# EAGLE design rev1 (EAGLE 7.7.0)
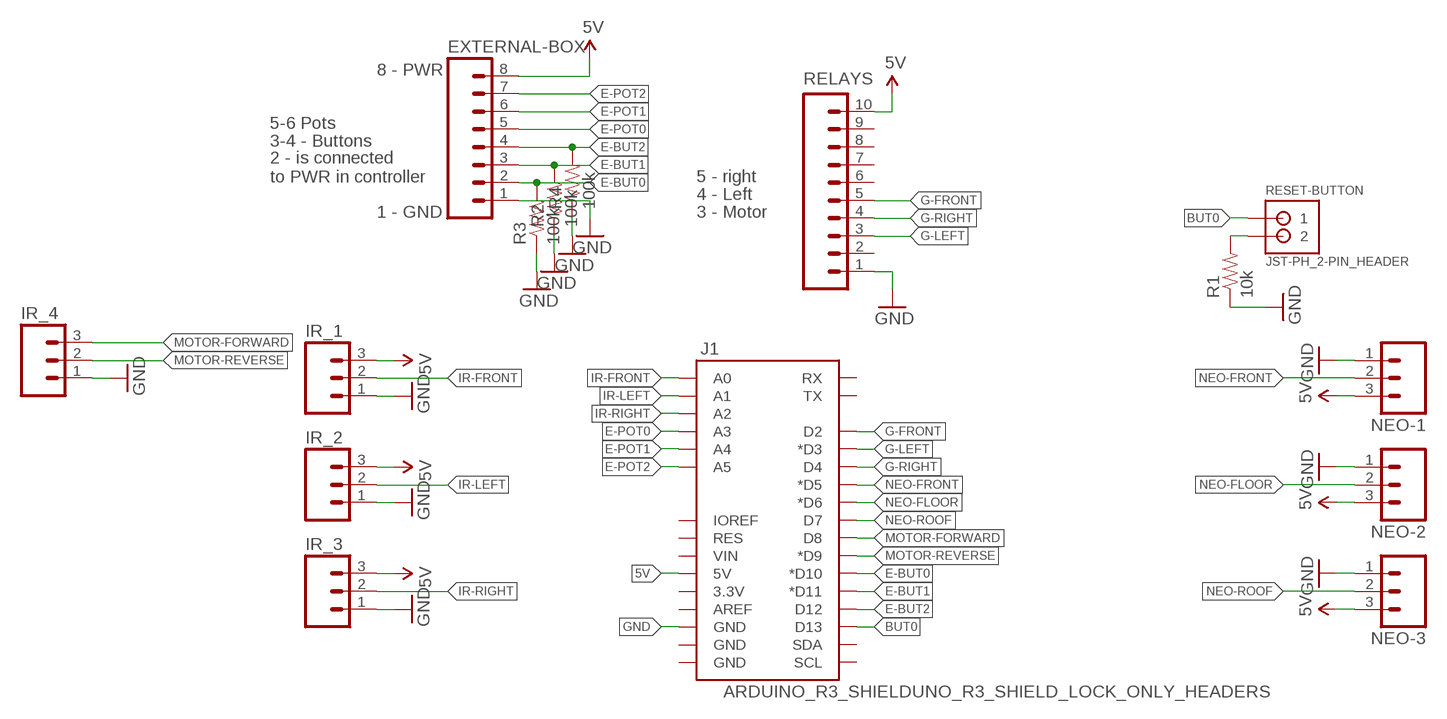
[diagram p0: schematic, sheet 1]

## Parts
EXTERNAL-BOX  M08NO_SILK  [1X08_PIN1_NO_SILK]
IR_1  M03POLAR  [MOLEX-1X3]
IR_2  M03POLAR  [MOLEX-1X3]
IR_3  M03POLAR  [MOLEX-1X3]
IR_4  M03POLAR  [MOLEX-1X3]
J1  ARDUINO_R3_SHIELDUNO_R3_SHIELD_LOCK_ONLY_HEADERS  [UNO_R3_SHIELD_ONLY_HEADERS]
NEO-1  M03POLAR  [MOLEX-1X3]
NEO-2  M03POLAR  [MOLEX-1X3]
NEO-3  M03POLAR  [MOLEX-1X3]
R1  10k  RESISTORAXIAL-0.3  [AXIAL-0.3]
R2  100k  RESISTORAXIAL-0.3  [AXIAL-0.3]
R3  100k  RESISTORAXIAL-0.3  [AXIAL-0.3]
R4  100k  RESISTORAXIAL-0.3  [AXIAL-0.3]
RELAYS  M10NO_SILK_PTH_FEMALE  [1X10_NO_SILK]
RESET-BUTTON  JST-PH_2-PIN_HEADER  [JST_B2B-PH_HEADER]

## Nets
5V: EXTERNAL-BOX.8 IR_1.3 IR_2.3 IR_3.3 J1.5V NEO-1.3 NEO-2.3 NEO-3.3 RELAYS.10
BUT0: J1.D13 RESET-BUTTON.P1
E-BUT0: EXTERNAL-BOX.2 J1.D10(*D10) R3.P$2
E-BUT1: EXTERNAL-BOX.3 J1.D11(*D11) R2.P$2
E-BUT2: EXTERNAL-BOX.4 J1.D12 R4.P$2
E-POT0: EXTERNAL-BOX.5 J1.A3
E-POT1: EXTERNAL-BOX.6 J1.A4
E-POT2: EXTERNAL-BOX.7 J1.A5
G-FRONT: J1.D2 RELAYS.5
G-LEFT: J1.D3(*D3) RELAYS.3
G-RIGHT: J1.D4 RELAYS.4
GND: EXTERNAL-BOX.1 IR_1.1 IR_2.1 IR_3.1 IR_4.1 J1.GND@2(GND) NEO-1.1 NEO-2.1 NEO-3.1 R1.P$1 R2.P$1 R3.P$1 R4.P$1 RELAYS.1
IR-FRONT: IR_1.2 J1.A0
IR-LEFT: IR_2.2 J1.A1
IR-RIGHT: IR_3.2 J1.A2
MOTOR-FORWARD: IR_4.3 J1.D8
MOTOR-REVERSE: IR_4.2 J1.D9(*D9)
N$2: R1.P$2 RESET-BUTTON.P2
NEO-FLOOR: J1.D6(*D6) NEO-2.2
NEO-FRONT: J1.D5(*D5) NEO-1.2
NEO-ROOF: J1.D7 NEO-3.2
Unconnected: J1.3.3V J1.AREF J1.GND@0(GND) J1.GND@1(GND) J1.IOREF J1.RES J1.RX J1.SCL J1.SDA J1.TX J1.VIN RELAYS.2 RELAYS.6 RELAYS.7 RELAYS.8 RELAYS.9

## Notes on the sheet
- 8 - PWR
- 5-6 Pots
- 3-4 - Buttons
- 2 - is connected
  to PWR in controller
- 5 - right
- 4 - Left
- 1 - GND | 3 - Motor

## Library data of the parts
EXTERNAL-BOX = SparkFun-Connectors:M08: Header 8 Standard 8-pin 0.1" header. Use with straight break away headers (SKU : PRT-00116), right angle break away headers (PRT-00553), swiss pins (PRT-00743), machine pins (PRT-00117), and female headers (PRT-00115).
IR_1-IR_4 NEO-1-NEO-3 = SparkFun-Connectors:M03: Header 3 Standard 3-pin 0.1" header. Use with straight break away headers (SKU : PRT-00116), right angle break away headers (PRT-00553), swiss pins (PRT-00743), machine pins (PRT-00117), and female headers (PRT-00115). Molex polarized connector foot print use with SKU : PRT-08232 with associated crimp pins and housings.
J1 = Arduino-Uno-Mega:ARDUINO_R3_SHIELD: Shield form compatible with the Arduino Uno R3.
R1-R4 = SparkFun-Passives:RESISTOR: Resistor Basic schematic elements and footprints for 0603, 1206, and PTH resistors.
RELAYS = SparkFun-Connectors:M10: Header 10 Standard 10-pin 0.1" header. Use with straight break away headers (SKU : PRT-00116), right angle break away headers (PRT-00553), swiss pins (PRT-00743), machine pins (PRT-00117), and female headers (PRT-00115).; PROD_ID: CONN-11563
RESET-BUTTON = JST_connectors:JST-PH_2-PIN_HEADER: 2-pin JST PH Shrouded Header, top entry P/N B2B-PH-K-S Mating connector PHR-2 Mating cable assembly: Sparkfun PRT-09914 <http://www.sparkfun.com/products/9914>

## Board
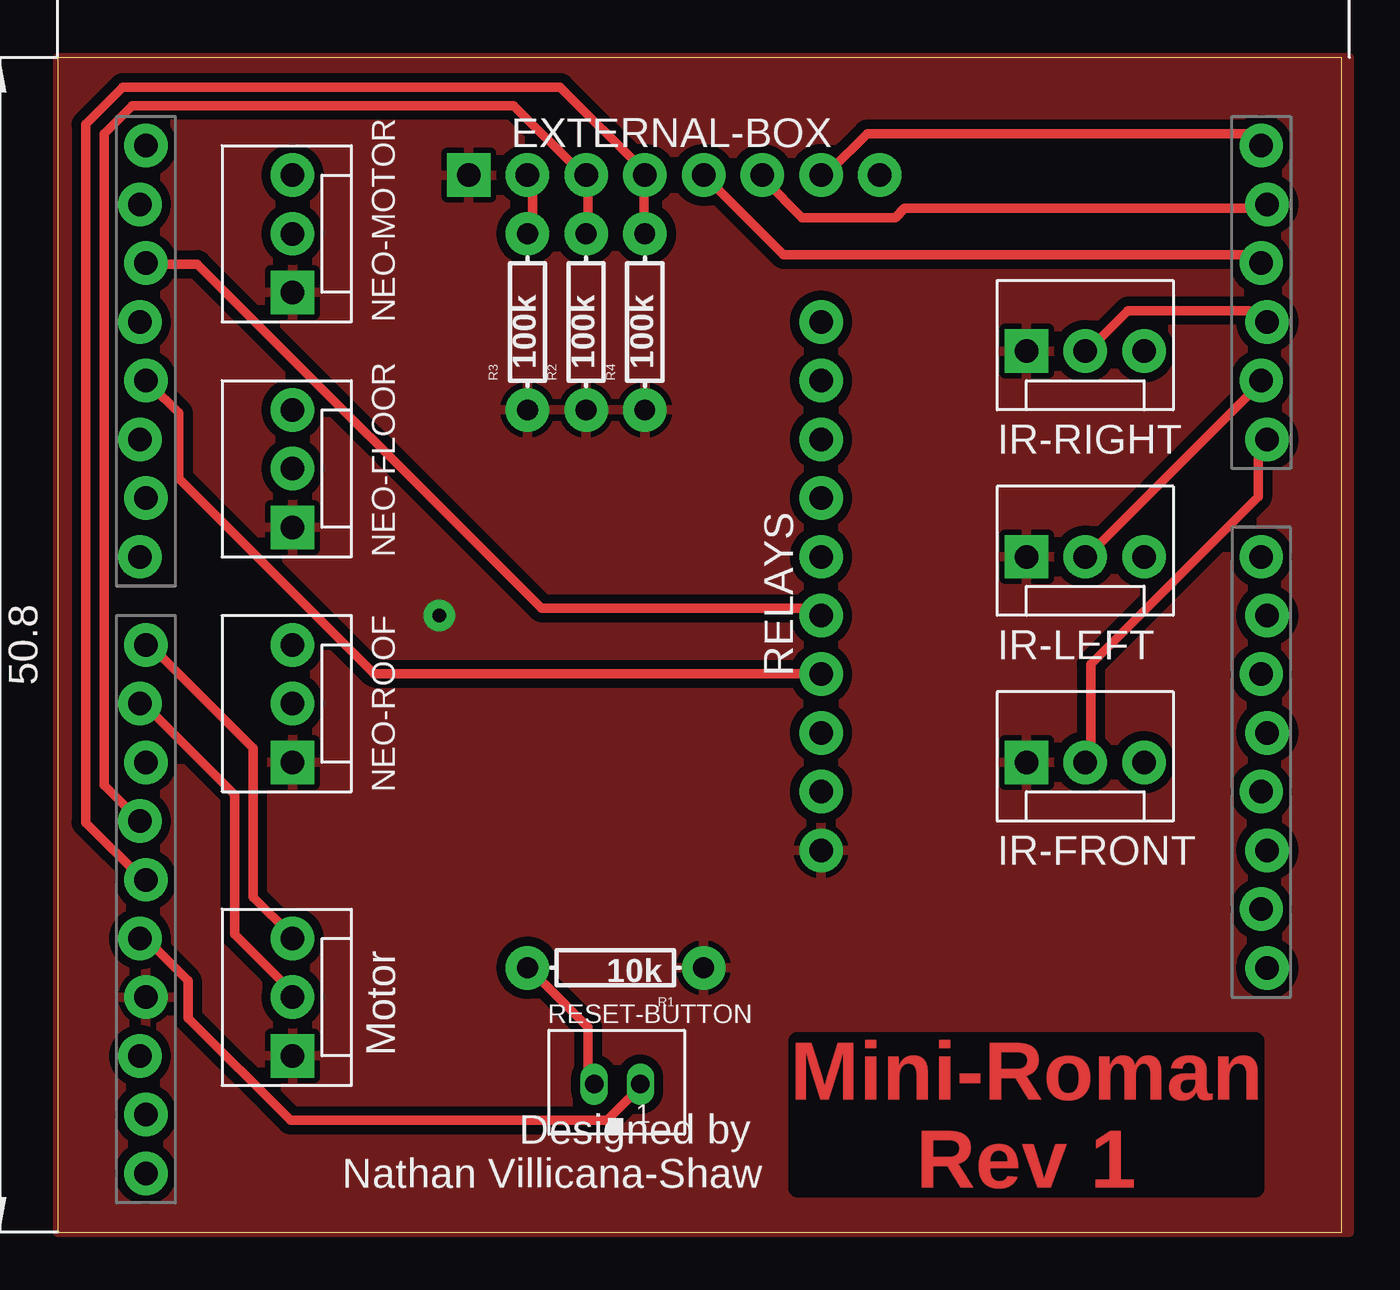
[diagram p1: board, top side]
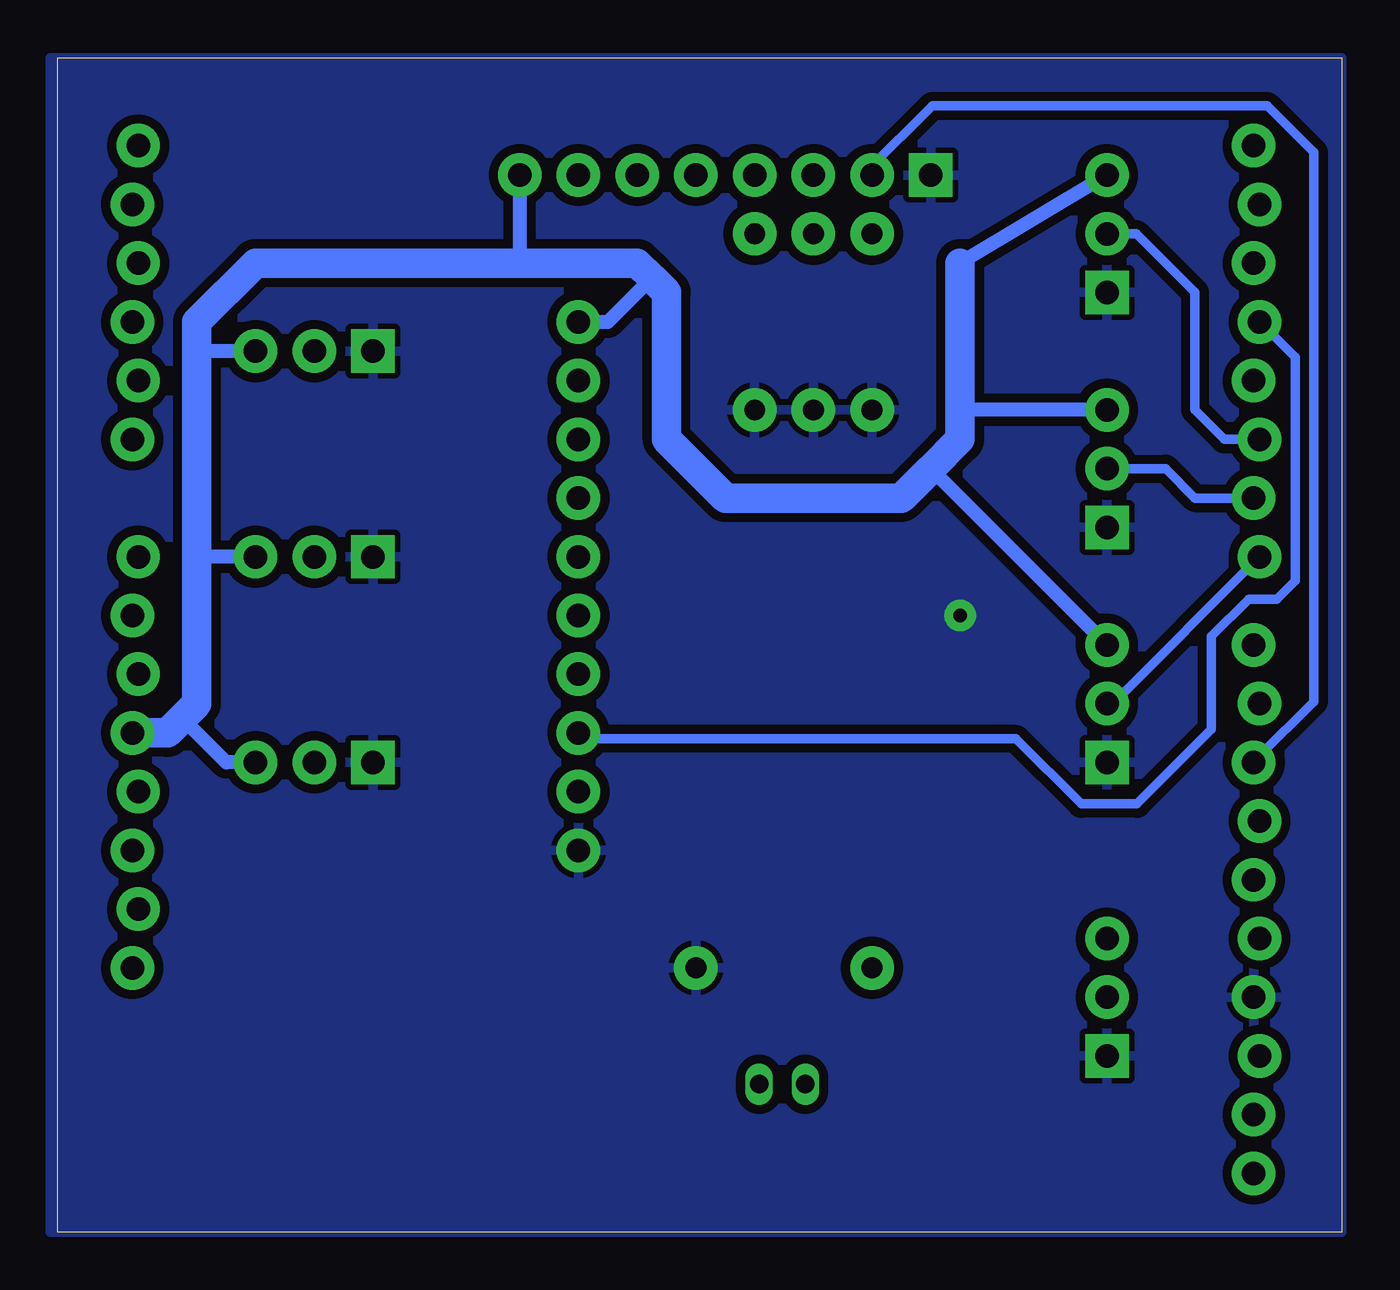
[diagram p2: board, bottom side, seen from below]

Size 55.55 x 50.79 mm. Coordinates in mm from the lower left corner, seen from the top.
Outline: 0,0 55.55,0 55.55,50.79 0,50.79 0,0
Copper layers (1*16): Top 0.035mm / dielectric 1.5mm / Bottom 0.035mm
Design rules "OthermillDRC_1_64_v2": minimum track width 16mil, minimum drill 31mil, track to track 0.39878125mm, track to pad 0.39878125mm, pad to pad 0.39878125mm, via to via 0.39878125mm, smd to smd 0mil, copper to edge 0mil, drill to drill 1mil, minimum pad ring 0mil, minimum via ring 15mil, stop-mask expansion 1mil, vias tented up to drill 30mil, thermal gap 10mil

### Footprints (pad centres in the part's own frame; a part is rotated, then mirrored left to right if it is on the bottom)
1X08_PIN1_NO_SILK = drill 1.016 pad 1.88 square: 1 0,0 | drill 1.016 pad 1.88: 2 2.54,0; 3 5.08,0; 4 7.62,0; 5 10.16,0; 6 12.7,0; 7 15.24,0; 8 17.78,0
MOLEX-1X3 = drill 1.016 pad 1.88 square: 1 0,0 | drill 1.016 pad 1.88: 2 2.54,0; 3 5.08,0
UNO_R3_SHIELD_ONLY_HEADERS = drill 1.016 pad 1.88: 3.3V 50.8,26.67; 5V 51.054,29.21; A0 51.054,41.91; A1 50.8,44.45; A2 51.054,46.99; A3 50.8,49.53; A4 51.054,52.07; A5 50.8,54.61; AREF 2.286,15.24; D2 2.54,49.53; D3 2.286,46.99; D4 2.54,44.45; D5 2.286,41.91; D6 2.54,39.37; D7 2.286,36.83; D8 2.54,33.02; D9 2.286,30.48; D10 2.54,27.94; D11 2.286,25.4; D12 2.54,22.86; D13 2.286,20.32; GND@0 50.8,31.75; GND@1 51.054,34.29; GND@2 2.54,17.78; IOREF 50.8,21.59; NC 51.054,19.05; RES 51.054,24.13; RX 2.54,54.61; SCL 2.54,10.16; SDA 2.54,12.7; TX 2.286,52.07; VIN 50.8,36.83
AXIAL-0.3 = drill 0.9 pad 1.88: P$1 -3.81,0; P$2 3.81,0
1X10_NO_SILK = drill 1.016 pad 1.88: 1 0,0; 2 2.54,0; 3 5.08,0; 4 7.62,0; 5 10.16,0; 6 12.7,0; 7 15.24,0; 8 17.78,0; 9 20.32,0; 10 22.86,0
JST_B2B-PH_HEADER = drill 0.8 long: P1 1.075,0.048; P2 -0.925,0.048

### Placement (x,y rotation side)
EXTERNAL-BOX  17.78,45.72 0 top
IR_1  41.91,20.32 0 top
IR_2  41.91,29.21 0 top
IR_3  41.91,38.1 0 top
IR_4  10.16,7.62 90 top
J1  1.27,-7.62 0 top
NEO-1  10.16,40.64 90 top
NEO-2  10.16,30.48 90 top
NEO-3  10.16,20.32 90 top
R1  24.13,11.43 180 top
R2  22.86,39.37 90 top
R3  20.32,39.37 90 top
R4  25.4,39.37 90 top
RELAYS  33.02,16.51 90 top
RESET-BUTTON  24.13,6.35 0 top

### Tracks (layer width: path | path; a pad name or v marks a point on that pad's centre or on a via)
5V
  Bottom 0.61: NEO-1.3 16.51,41.91 | NEO-2.3 16.51,35.56 | NEO-3.3 17.78,33.02 | RELAYS.10 31.75,39.37 29.84,41.27 | EXTERNAL-BOX.8 35.56,41.91 | IR_3.3 49.53,38.1 | IR_2.3 49.53,29.21 | IR_1.3 48.26,20.32 50.16,22.23
  Bottom 1.27: 16.51,41.91 16.51,35.56 16.51,34.29 17.78,33.02 19.05,31.75 26.67,31.75 29.21,34.29 29.21,40.64 29.84,41.27 30.48,41.91 35.56,41.91 46.99,41.91 49.53,39.37 49.53,38.1 49.53,29.21 49.53,22.86 50.16,22.23 50.8,21.59 J1.5V
BUT0
  Top 0.406: RESET-BUTTON.P1 24.96,6.04 23.75,4.83 10.06,4.83 5.64,9.26 5.64,10.87 3.62,12.88 J1.D13
  Bottom 0.406: 3.75,12.51 J1.D13
E-BUT0
  Top 0.406: R3.P$2 20.53,43.48 20.53,45.49 EXTERNAL-BOX.2
  Bottom 0.406: J1.D10 3.62,20.53 1.21,22.95 1.21,46.7 3.22,48.71 17.71,48.71 20.53,45.9 EXTERNAL-BOX.2
E-BUT1
  Top 0.406: J1.D11 3.22,18.12 2.01,19.32 2.01,47.51 3.22,48.71 19.73,48.71 22.55,45.9 EXTERNAL-BOX.3 22.95,45.49 22.95,43.48 R2.P$2
E-BUT2
  Top 0.406: J1.D12 3.62,15.3 1.21,17.71 1.21,47.91 2.82,49.52 21.74,49.52 25.36,45.9 EXTERNAL-BOX.4 25.36,45.49 25.36,43.48 R4.P$2
E-POT0
  Top 0.406: J1.A3 51.93,42.27 31.4,42.27 28.18,45.49 EXTERNAL-BOX.5
E-POT1
  Top 0.406: J1.A4 51.93,44.28 36.64,44.28 36.23,43.88 32.21,43.88 30.6,45.49 EXTERNAL-BOX.6
E-POT2
  Top 0.406: EXTERNAL-BOX.7 33.41,45.9 35.02,47.51 51.53,47.51 51.93,47.1 J1.A5
G-FRONT
  Top 0.406: RELAYS.5 33.01,26.97 20.93,26.97 6.04,41.87 4.03,41.87 J1.D2
G-LEFT
  Bottom 0.406: RELAYS.3 33.01,21.34 14.09,21.34 11.27,18.52 8.86,18.52 5.64,21.74 5.64,25.77 4.03,27.38 2.82,27.38 2.01,28.18 2.01,37.84 3.22,39.05 J1.D3
G-RIGHT
  Top 0.406: RELAYS.4 33.01,24.16 13.69,24.16 5.23,32.61 5.23,35.43 4.03,36.64 J1.D4
GND  (via drill 0.6)
  other vias: 16.51,26.67
  pour Top: 0,50.8 55.88,50.8 55.88,0 0,0
  pour Bottom: 0,50.8 55.88,50.8 55.88,0 0,0
IR-FRONT
  Top 0.406: IR_1.2 44.69,20.53 44.69,24.56 51.93,31.8 51.93,34.22 J1.A0
IR-LEFT
  Top 0.406: IR_2.2 44.69,29.39 51.93,36.64 J1.A1
IR-RIGHT
  Top 0.406: IR_3.2 44.69,38.25 46.3,39.86 51.53,39.86 51.93,39.45 J1.A2
MOTOR-FORWARD
  Top 0.406: J1.D8 4.03,25.36 8.45,20.93 8.45,14.49 10.06,12.88 IR_4.3
MOTOR-REVERSE
  Top 0.406: J1.D9 3.62,22.55 4.03,22.55 7.65,18.92 7.65,12.88 10.06,10.47 IR_4.2
N$2
  Top 0.406: RESET-BUTTON.P2 22.95,6.44 22.95,8.86 20.53,11.27 R1.P$2
NEO-FLOOR
  Bottom 0.406: NEO-2.2 7.62,33.02 6.35,31.75 J1.D6
NEO-FRONT
  Bottom 0.406: NEO-1.2 8.89,43.18 6.35,40.64 6.35,35.56 5.08,34.29 J1.D5
NEO-ROOF
  Bottom 0.406: NEO-3.2 9.91,22.86 J1.D7

### Text on the board
Top: Mini-Roman / Rev 1
tNames: NEO-MOTOR | IR-RIGHT | NEO-FLOOR | IR-LEFT | NEO-ROOF | IR-FRONT | Motor | Designed by / Nathan Villicana-Shaw